# EAGLE schematic 325V-Gleichstrom-Motor-an-Phasenanschnittsteuerung_Prinzip-Schema (EAGLE 7.4.0)
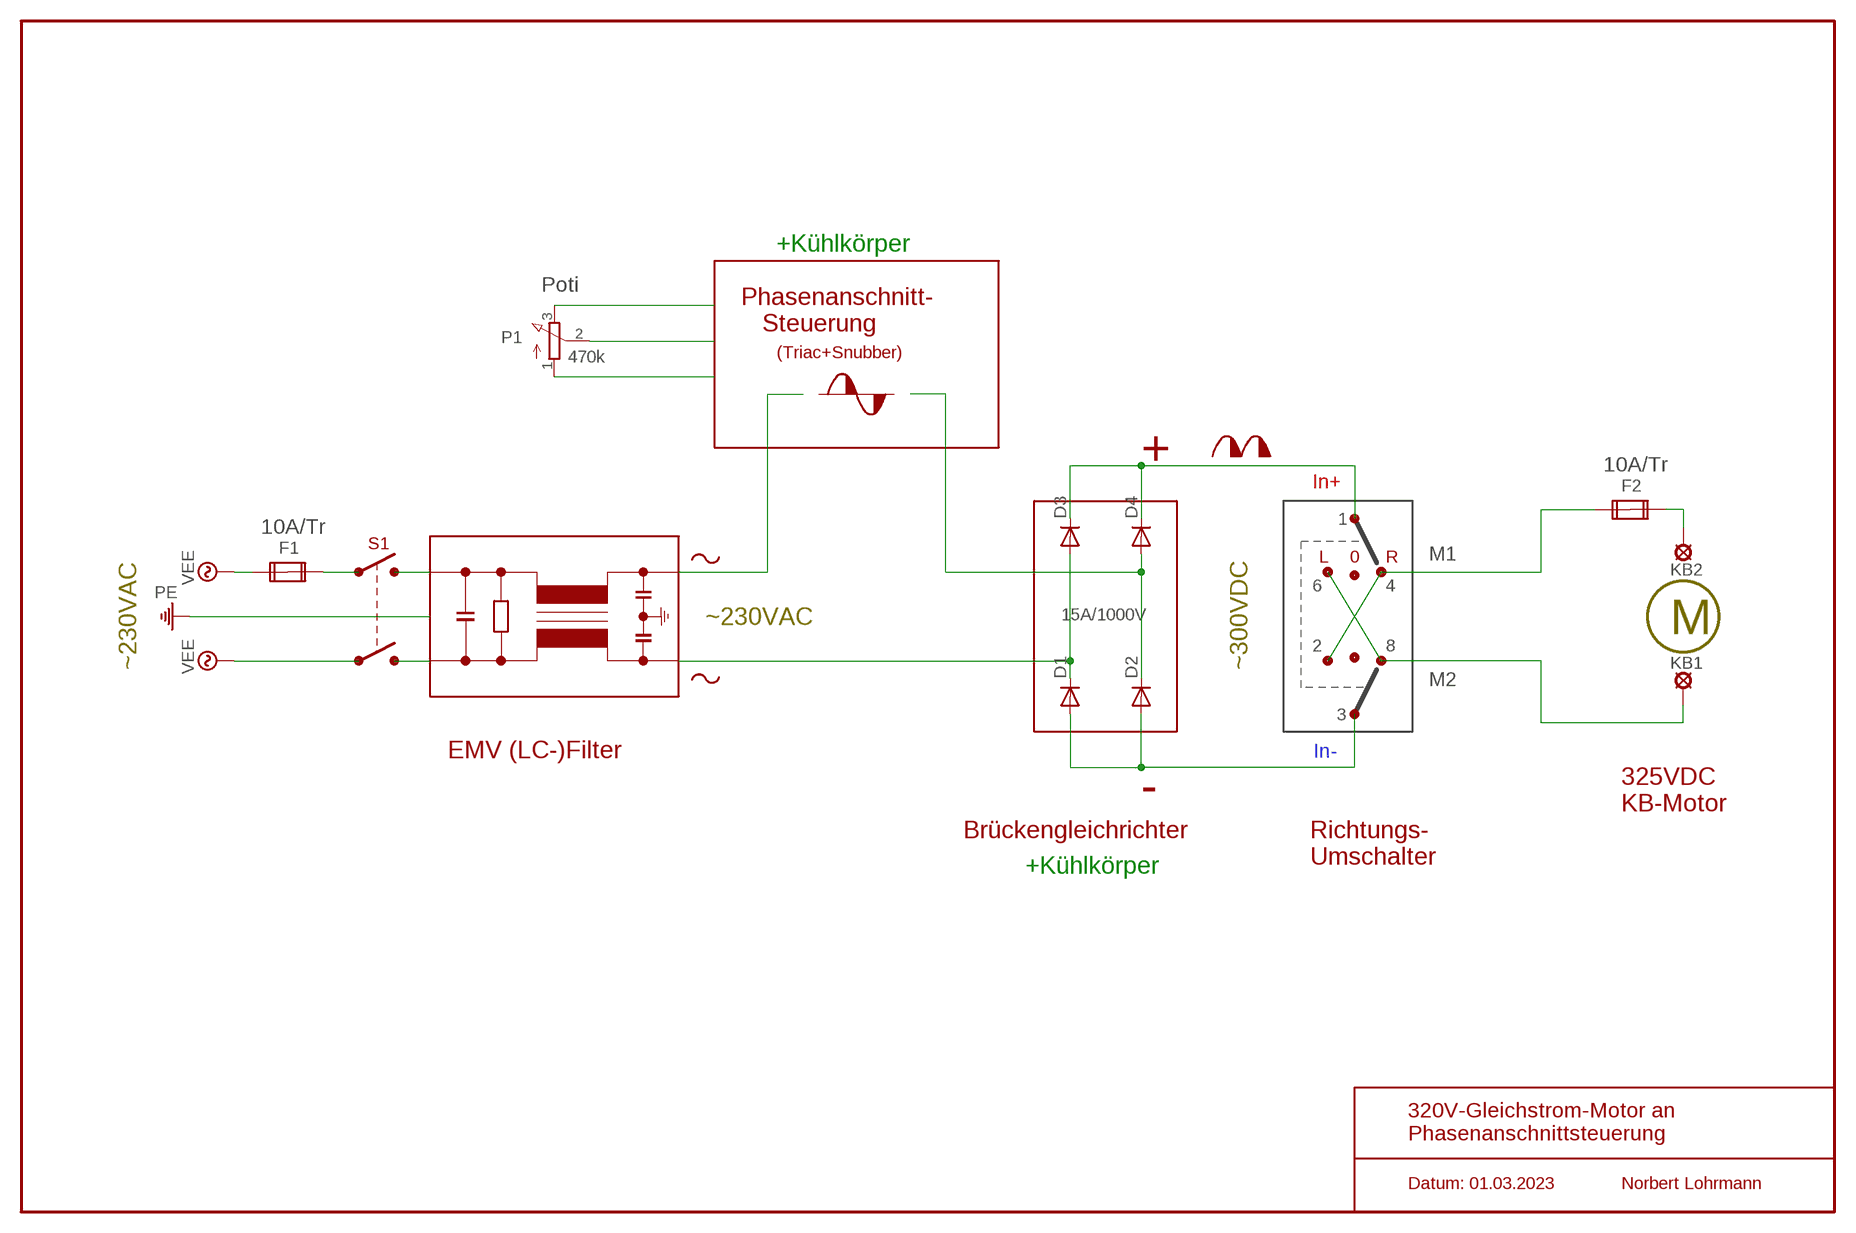
[diagram p0: schematic, sheet 1]

## Parts
D1  DIODE-D-2.5  [D-2.5]
D2  DIODE-D-2.5  [D-2.5]
D3  DIODE-D-2.5  [D-2.5]
D4  DIODE-D-2.5  [D-2.5]
F1  10A/Tr  FUSE2P  [FUSE1]
F2  10A/Tr  FUSE2P  [FUSE1]
KB1  LSP10  [LSP10]
KB2  LSP10  [LSP10]
P1  Poti  3RP/1610N  [3RP/1610N]

## Nets
N$6: P1.3(E)
N$7: P1.2(S)
N$8: P1.1(A)
N$9: D1.A D2.A
N$11: D1.C D3.A
N$12: D2.C D4.A
N$13: D3.C D4.C
N$14: F1.2A
N$16: F2.2A KB2.MP
N$19: KB1.MP
N$20: F2.1A
VEE: F1.1A
Unconnected: F1.1B F1.2B F2.1B F2.2B

## Notes on the sheet
- +Kühlkörper
- Phasenanschnitt-
     Steuerung
- 470k | (Triac+Snubber)
- +
- In+
- 1
- S1
- L | 0 | R | M1
- 6 | 4
- ~230VAC | 15A/1000V
- M
- 2 | 8
- ~230VAC | ~300VDC
- M2
- 3
- EMV (LC-)Filter | In-
- -
- 325VDC
  KB-Motor
- Brückengleichrichter
- Richtungs-
  Umschalter
- +Kühlkörper
- 320V-Gleichstrom-Motor an
  Phasenanschnittsteuerung
- Datum: 01.03.2023 | Norbert Lohrmann

## Library data of the parts
D1-D4 = diode1:DIODE-: DIODE
F1 F2 = special:FUSE2P: FUSE 5 x 20 mm
KB1 KB2 = solpad:LSP10: SOLDER PAD drill 1.0 mm, distributor Buerklin, 12H555
P1 = pot:3RP/1610N: 16mm Potentiometer one level Source: http://www.alphapotentiometers.net/html/16mm_pot_2.html